# EAGLE design IronSAMD51 (EAGLE 9.0.1)
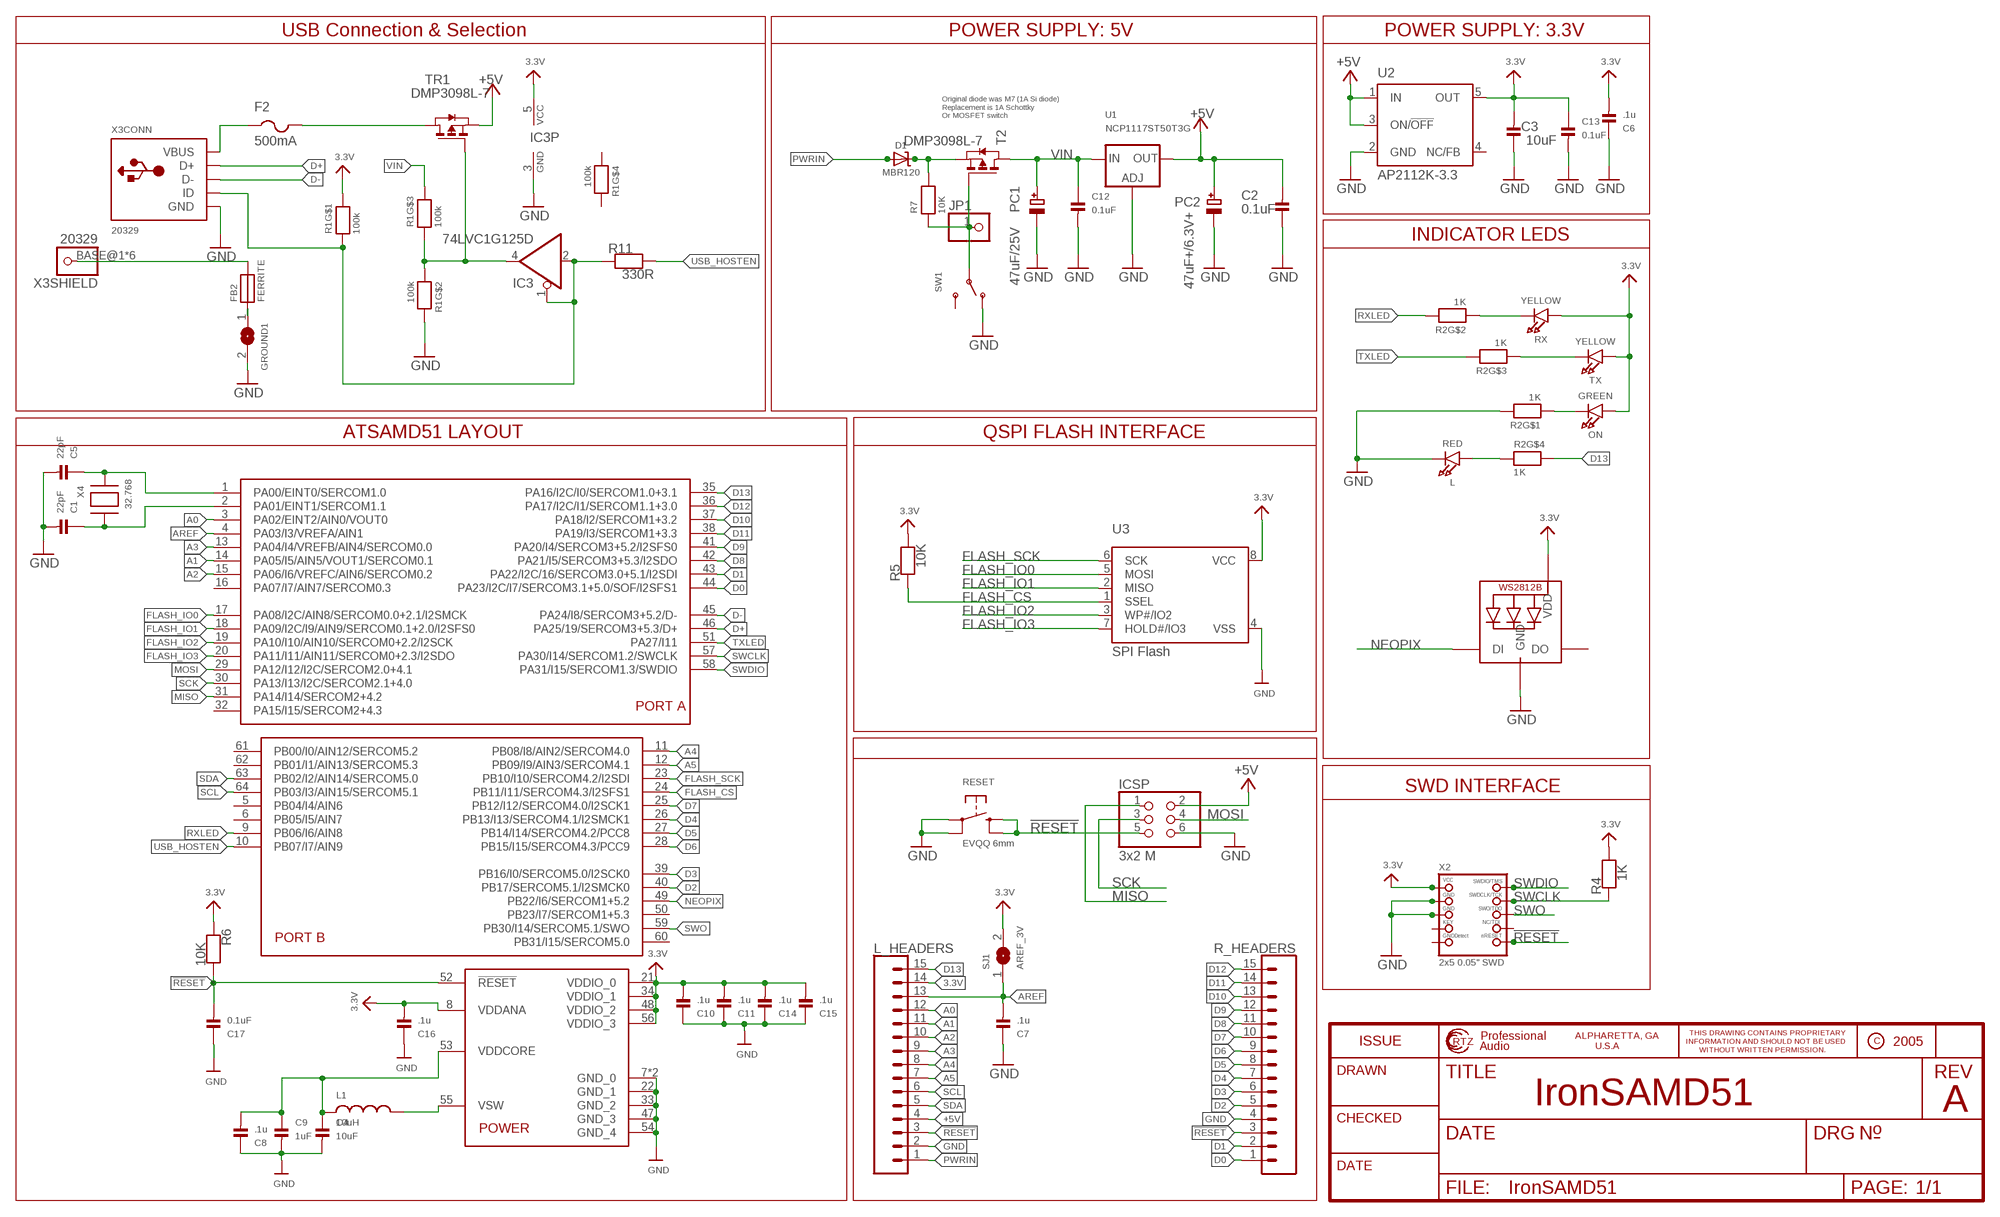
[diagram p0: schematic, sheet 1]

## Parts
C1  22pF  CAP_CERAMIC0603  [0603]
C2  0.1uF  CAP_CERAMIC0805  [0805]
C3  10uF  CAP_CERAMIC0805  [0805]
C4  10uF  CAP_CERAMIC0805  [0805]
C5  22pF  CAP_CERAMIC0603  [0603]
C6  .1u  CAP_CERAMIC0603  [0603]
C7  .1u  CAP_CERAMIC0603  [0603]
C8  .1u  CAP_CERAMIC0603  [0603]
C9  1uF  CAP_CERAMIC0603  [0603]
C10  .1u  CAP_CERAMIC0603  [0603]
C11  .1u  CAP_CERAMIC0603  [0603]
C12  0.1uF  CAP_CERAMIC0603  [0603]
C13  0.1uF  CAP_CERAMIC0603  [0603]
C14  .1u  CAP_CERAMIC0603  [0603]
C15  .1u  CAP_CERAMIC0603  [0603]
C16  .1u  CAP_CERAMIC0603  [0603]
C17  0.1uF  CAP_CERAMIC0603  [0603]
D1  MBR120  DIODE-SCHOTTKYSOD-123  [SOD-123]
F2  500mA  PTCFUSE-1206  [R1206]
FB2  FERRITE  [0603]
GROUND1  SOLDERJUMPERCLOSED  [SOLDERJUMPER_CLOSEDWIRE]
IC3  74LVC1G125D  74AHC1G125DBV  [SOT23-5]
ICSP  3x2 M  HEADER-2X3  [2X03_ROUND_70MIL]
JP1  HEADER-1X1ROUND  [1X01_ROUND]
L  RED  LED0805_NOOUTLINE  [CHIPLED_0805_NOOUTLINE]
L1  10uH  INDUCTOR  [INDUCTOR_1007]
L_HEADERS  CONN_15  [1X15]
LED1  WS2812B3535  [LED3535]
ON  GREEN  LED0805_NOOUTLINE  [CHIPLED_0805_NOOUTLINE]
PC1  47uF/25V  CAP_ELECTROLYTICPANASONIC_D  [PANASONIC_D]
PC2  47uF+/6.3V+  CAP_ELECTROLYTICPANASONIC_D  [PANASONIC_D]
R1  100k  RESISTOR_4PACK  [RESPACK_4X0603]
R2  1K  RESISTOR_4PACK  [RESPACK_4X0603]
R4  1K  RESISTOR0603  [0603]
R5  10K  RESISTOR0603  [0603]
R6  10K  RESISTOR0603  [0603]
R7  10K  RESISTOR0603  [0603]
R11  330R  RESISTOR0603  [0603]
R_HEADERS  CONN_15  [1X15]
RESET  EVQQ 6mm  SWITCH_TACT_SMT  [EVQ-Q2]
RX  YELLOW  LED0805_NOOUTLINE  [CHIPLED_0805_NOOUTLINE]
SJ1  AREF_3V  SOLDERJUMPERCLOSED  [SOLDERJUMPER_CLOSEDWIRE]
SW1  SWITCH_SPDT  [SPDT_SMT_SSSS811101]
T2  DMP3098L-7  PMOSSOT23  [SOT-23]
TR1  DMP3098L-7  0297_PMV48XP  [SOT-23]
TX  YELLOW  LED0805_NOOUTLINE  [CHIPLED_0805_NOOUTLINE]
U1  NCP1117ST50T3G  LM1117SOT223-REFLOW  [SOT223-R]
U2  AP2112K-3.3  LP2985-XXDBVR33  [SOT23-DBV]
U3  SPI Flash  SPIFLASH_SOIC8208MIL  [SOIC8_208MIL]
U$3  ATSAMD51J  [PQFN64-1]
X2  2x5 0.05" SWD  JTAG-CORTEXBOXPOSTS  [2X05_1.27MM_BOX_POSTS]
X3  20329  USB_W_SHIELD_V2  [4UCONN_20329_V2]
X4  32.768  XTAL-3.2X1.5  [XTAL3215]

## Nets
3.3V: C3.2 C6.2 C10.2 C11.2 C13.1 C14.2 C15.2 C16.2 IC3.5(VCC) L_HEADERS.14 LED1.2(VDD) ON.A R1.8 R4.2 R5.2 R6.1 RX.A SJ1.2 TX.A U2.5(OUT) U3.8(VCC) U$3.8(VDDANA) U$3.21(VDDIO_0) U$3.34(VDDIO_1) U$3.48(VDDIO_2) U$3.56(VDDIO_3) X2.1(VCC)
!RESET: C17.2 ICSP.5 L_HEADERS.3 R6.2 R_HEADERS.3 RESET.B'(S1) RESET.B(S) U$3.52(!RESET) X2.10(NRESET)
+5V [usbvcc]: C2.2 ICSP.2 L_HEADERS.4 PC2.+ TR1.2(S) U1.2(OUT) U1.4(OUT) U2.1(IN) U2.3(ON/!OFF)
A0: L_HEADERS.12 U$3.3(PA02/EINT2/AIN0/VOUT0)
A1: L_HEADERS.11 U$3.14(PA05/I5/AIN5/VOUT1/SERCOM0.1)
A2: L_HEADERS.10 U$3.15(PA06/I6/VREFC/AIN6/SERCOM0.2)
A3: L_HEADERS.9 U$3.13(PA04/I4/VREFB/AIN4/SERCOM0.0)
A4: L_HEADERS.8 U$3.11(PB08/I8/AIN2/SERCOM4.0)
A5: L_HEADERS.7 U$3.12(PB09/I9/AIN3/SERCOM4.1)
AREF: C7.2 L_HEADERS.13 SJ1.1 U$3.4(PA03/I3/VREFA/AIN1)
D0: R_HEADERS.1 U$3.44(PA23/I2C/I7/SERCOM3.1+5.0/SOF/I2SFS1)
D1: R_HEADERS.2 U$3.43(PA22/I2C/16/SERCOM3.0+5.1/I2SDI)
D2: R_HEADERS.5 U$3.40(PB17/SERCOM5.1/I2SMCK0)
D3: R_HEADERS.6 U$3.39(PB16/I0/SERCOM5.0/I2SCK0)
D4: R_HEADERS.7 U$3.26(PB13/I13/SERCOM4.1/I2SMCK1)
D5: R_HEADERS.8 U$3.27(PB14/I14/SERCOM4.2/PCC8)
D6: R_HEADERS.9 U$3.28(PB15/I15/SERCOM4.3/PCC9)
D7: R_HEADERS.10 U$3.25(PB12/I12/SERCOM4.0/I2SCK1)
D8: R_HEADERS.11 U$3.42(PA21/I5/SERCOM3+5.3/I2SDO)
D9: R_HEADERS.12 U$3.41(PA20/I4/SERCOM3+5.2/I2SFS0)
D10: R_HEADERS.13 U$3.37(PA18/I2/SERCOM1+3.2)
D11: R_HEADERS.14 U$3.38(PA19/I3/SERCOM1+3.3)
D12: R_HEADERS.15 U$3.36(PA17/I2C/I1/SERCOM1.1+3.0)
D13: L_HEADERS.15 R2.5 U$3.35(PA16/I2C/I0/SERCOM1.0+3.1)
D+: U$3.46(PA25/19/SERCOM3+5.3/D+) X3.D+(CONN:D+)
D-: U$3.45(PA24/I8/SERCOM3+5.2/D-) X3.D-(CONN:D-)
FLASH_CS: R5.1 U3.1(SSEL) U$3.24(PB11/I11/SERCOM4.3/I2SFS1)
FLASH_IO0: U3.5(MOSI) U$3.17(PA08/I2C/AIN8/SERCOM0.0+2.1/I2SMCK)
FLASH_IO1: U3.2(MISO) U$3.18(PA09/I2C/I9/AIN9/SERCOM0.1+2.0/I2SFS0)
FLASH_IO2: U3.3(WP#/IO2) U$3.19(PA10/I10/AIN10/SERCOM0+2.2/I2SCK)
FLASH_IO3: U3.7(HOLD#/IO3) U$3.20(PA11/I11/AIN11/SERCOM0+2.3/I2SDO)
FLASH_SCK: U3.6(SCK) U$3.23(PB10/I10/SERCOM4.2/I2SDI)
GND: C1.2 C2.1 C3.1 C4.2 C5.2 C6.1 C7.1 C8.1 C9.2 C10.1 C11.1 C12.2 C13.2 C14.1 C15.1 C16.1 C17.1 GROUND1.2 IC3.3(GND) ICSP.6 L.C L_HEADERS.2 LED1.4(GND) PC1.- PC2.- R1.7 R2.8 R_HEADERS.4 RESET.A'(P1) RESET.A(P) SW1.A(O) U1.1(ADJ) U2.2(GND) U3.4(VSS) U$3.7(GND_0) U$3.22(GND_1) U$3.33(GND_2) U$3.47(GND_3) U$3.54(GND_4) U$3.EXP(GND_0) X2.3(GND) X2.5(GND) X3.GND(CONN:GND)
MISO: ICSP.1 U$3.31(PA14/I14/SERCOM2+4.2)
MOSI: ICSP.4 U$3.29(PA12/I12/I2C/SERCOM2.0+4.1)
N$1: F2.1 X3.VBUS(CONN:VBUS)
N$3: F2.2 TR1.1(D)
N$4: IC3.4(O) R1.2 R1.3 TR1.3(G)
N$5: ON.C R2.1
N$6: FB2.1 GROUND1.1
N$7: R2.2 RX.C
N$8: R2.3 TX.C
N$9: L.A R2.4
N$10: IC3.1(OE) IC3.2(I) R1.1 R11.1 X3.ID(CONN:ID)
N$11: C5.1 U$3.1(PA00/EINT0/SERCOM1.0) X4.P$1
N$12: C1.1 U$3.2(PA01/EINT1/SERCOM1.1) X4.P$2
N$13: L1.P$2 U$3.55(VSW)
N$14: C4.1 C8.2 C9.1 L1.P$1 U$3.53(VDDCORE)
N$15: D1.C R7.2 T2.2(S)
NEOPIX: LED1.1(DI) U$3.49(PB22/I6/SERCOM1+5.2)
PWR_SWITCH: JP1.1 R7.1 SW1.B(P) T2.3(G)
PWRIN [USB]: D1.A L_HEADERS.1
RXLED: R2.7 U$3.9(PB06/I6/AIN8)
SCK: ICSP.3 U$3.30(PA13/I13/I2C/SERCOM2.1+4.0)
SCL: L_HEADERS.6 U$3.64(PB03/I3/AIN15/SERCOM5.1)
SDA: L_HEADERS.5 U$3.63(PB02/I2/AIN14/SERCOM5.0)
SWCLK: R4.1 U$3.57(PA30/I14/SERCOM1.2/SWCLK) X2.4(SWDCLK)
SWDIO: U$3.58(PA31/I15/SERCOM1.3/SWDIO) X2.2(SWDIO)
SWO: U$3.59(PB30/I14/SERCOM5.1/SWO) X2.6(SWO)
TXLED: R2.6 U$3.51(PA27/I11)
USB_HOSTEN: R11.2 U$3.10(PB07/I7/AIN9)
USHIELD [gnd]: FB2.2 X3.BASE@1 X3.BASE@2 X3.SPRT@1 X3.SPRT@2 X3.SPRT@3 X3.SPRT@4
VIN: C12.1 PC1.+ R1.6 T2.1(D) U1.3(IN)
Unconnected: LED1.3(DO) R1.4 R1.5 SW1.C(S) U2.4(NC/FB) U$3.5(PB04/I4/AIN6) U$3.6(PB05/I5/AIN7) U$3.16(PA07/I7/AIN7/SERCOM0.3) U$3.32(PA15/I15/SERCOM2+4.3) U$3.50(PB23/I7/SERCOM1+5.3) U$3.60(PB31/I15/SERCOM5.0) U$3.61(PB00/I0/AIN12/SERCOM5.2) U$3.62(PB01/I1/AIN13/SERCOM5.3) X2.7(KEY) X2.8(TDI) X2.9(GNDDETECT)

## Notes on the sheet
- USB Connection & Selection | POWER SUPPLY: 5V | POWER SUPPLY: 3.3V
- Original diode was M7 (1A Si diode)
  Replacement is 1A Schottky
  Or MOSFET switch
- INDICATOR LEDS
- ATSAMD51 LAYOUT | QSPI FLASH INTERFACE
- SWD INTERFACE
- IronSAMD51 | A

## Library data of the parts
C1-C17 = microbuilder:CAP_CERAMIC: Ceramic Capacitors 0402 - 0402 Surface Mount Capacitors 16pF 50V 5% [Digikey: 445-4899-2-ND] 18pF 50V 5% [Digikey: 490-1281-2-ND] 22pF 50V 5% [Digikey: 490-1283-2-ND] 68pF 50V 5% [Digikey: 490-1289-2-ND] 0.1uF 10V 10% [Digikey: 490-1318-2-ND] 1.0uF 6.3V 10% [Digikey: 490-1320-2-ND] 0603 - 0603 Surface Mount Capacitors 16 pF 50V 5% [Digikey: 445-5051-2-ND] 22 pF 50V [Digikey: PCC220ACVTR-ND] 33 pF 50V 5% [Digikey: 490-1415-1-ND] 56pF 50V 5% [Digikey: 490-1421-1-ND] 220pF 50V 5% [Digikey: 445-1285-1-ND] 680 pF 50V 2200 pF 50V 5% C0G [Digikey: 445-1297-1-ND] 5600 pF 100V 5% X7R [Digikey: 478-3711-1-ND] 0.1 µF 25V 10% [Digikey: PCC2277TR-ND] 0.22 µF 16V 10% X7R [Digikey: 445-1318-1-ND] 1.0 µF 25V 10% [Digikey: 445-5146-2-ND] 0603 - RF Specific 3pF 250V +/-0.1pF RF [Digikey: 712-1347-1-ND] 18 pF 250V 5% [Digikey: 478-3505-1-ND or 712-1322-1-ND] 56 pF 250V 5% C0G RF [Digikey: 490-4867-1-ND] 68 pF 250V RF [Digikey: 490-4868-1-ND] 0805 - 0805 Surface Mount Capacitors 220 pF 250V 2% RF Ceramic Capacitor [Digikey: 712-1398-1-ND] 1000 pF 50V 2% NP0 Ceramic Capacitor [Digikey: 478-3760-1-ND] 0.1 µF 25V 10% Ceramic Capacitor [Digikey: PCC1828TR-ND] 1.0 µF 16V 10% Ceramic Capacitor[Digikey: 490-1691-2-ND] 10.0 µF 10V 10% Ceramic Capacitor[Digikey: 709-1228-1-ND] 10.0 uF 16V 10% Ceramic Capacitor [Digikey: 478-5165-2-ND] 47 uF 6.3V 20% Ceramic Capacitor [Digikey: 587-1779-1-ND or 399-5506-1-ND] 1206 - 1206 Surface Mount Capacitors 47uF 10V 20% Ceramic Capacitor [Digikey: 490-5528-1-ND or 399-5508-1-ND or 445-6010-1-ND]
D1 = microbuilder:DIODE-SCHOTTKY
F2 = adafruit:PTCFUSE: PTC fuses, resettable thermistors
FB2 = microbuilder:FERRITE: Ferrite Bead 0603 MMZ1608B121C - 120 Ohm, 600mA Ferrite Chip - Digikey: 445-2164-1-ND BK1608HW121-T - 120 Ohm, 600mA Ferrite Chip - Digikey: 587-1876-2-ND
GROUND1 SJ1 = microbuilder:SOLDERJUMPER: SMD Solder JUMPER Solder the two pads together to create a connection, or remove the solder to break it. REFLOW - Use this footprint for solder paste and reflow ovens. WAVE - Use this footprint for hand-soldering (larger pads). CLOSED - Has a trace between the two pads to ensure it is closed by default. The trace needs to be cut to disable the jumper, and can be closed again by creating a solder bridge between the two pads.
IC3 = 74xx-little-de:74*1G125: Single Bus Buffer Gate with 3-State Output
ICSP = microbuilder:HEADER-2X3: PIN HEADER
JP1 = microbuilder:HEADER-1X1: PIN HEADER
L ON RX TX = microbuilder:LED: LED 0603 - 0603 Surface Mount Package 2mA: Green LED - Low Power (3.9mcd, 2ma, 1.7Vf) - Digikey: 475-2709-2-ND Orange LED - Low Power (9.8mcd, 2ma, 1.8Vf) - Digikey: 475-1194-2-ND Red LED - Low Power (5mcd, 2ma, 1.8Vf) - Digikey: 475-1195-2-ND Yellow LED - Low Power (7mcd, 2ma, 1.8Vf) - Digikey: 475-1196-2-ND 5mA: Blue LED - Low Power (17mcd, 5ma, 2.9Vf) - Digikey: LNJ937W8CRACT-ND 0805 - 0805 Surface Mount Package 2mA: Red LED (8.8mcd, 2mA, 1.8Vf, Clear) - Low Power [Digikey: 475-2510-1-ND] Green LED (5mcd, 2mA, 1.8Vf, Clear) - Low Power [Digikey: 475-2730-1-ND] Yellow LED (11.3mcd, 2mA, 1.8Vf, Clear) - Low Power [Digikey: 475-2555-1-ND] 20mA: Red LED (104mcd, 20mA, Diffused) - LS R976 [Digikey: 475-1278-6-ND] Red LED (12mcd, 20mA, 2.0Vf, Clear) - APT2012EC [Digikey: 754-1128-1-ND] Green LED (15mcd, 20mA, 2.2Vf, Clear) - APT2012GC [Digikey: 754-1131-1-ND] Orange LED (160mcd, 20mA, 2.1Vf, Clear) - APT2012SECK [Digikey: 754-1130-1-ND] 1206 - 1206 Surface Mount Package Green LED (26mcd, 20mA, Diffused) - LG N971 [Digikey: 475-1407-6-ND] Red LED (15mcd, 20mA, Diffused) - LH N974 [Digikey: 475-1416-6-ND] Cree - Cree High-Power Surface Mount LEDs XPEBWT-L1-0000-00D50 - White 111lm 350mA 2.9Vf 6200K 110° XTEAWT-00-0000-00000LEE3 - White 114lm 350mA 2.85Vf 5000K 115° Everlight - Everlight 45-21 Series Surface Mount LEDs 45-21/QK2C-B2832AC2CB2/2T - Warm White 2000mcd 20mA 3.25Vf 3050K 120° 45-21/LK2C-B38452C4CB2/2T - Nuetral White 2000mcd 20mA 3.25Vf 4150K 120° 45-21/LK2C-B50634C6CB2/2T - Cold White 2200mcd 20mA 3.25Vf 5650K 120° PLCC2 Reverse Mount LS T77K-J1L2-1-0-2-R18-Z - Red 11.25mcd 2mA 1.8Vf 630nm 120° LO T77K-L1M2-24-Z - Orange 19.6mcd 2mA 1.8Vf 606nm 120° LY T77K-K2M1-26-Z - Yellow 15.7mcd 2mA 1.8Vf 587nm 120°
L1 = microbuilder:INDUCTOR: Inductors 0603: 10nH Ceramic Inductor - microwire antenna/RF (Digikey: 712-1434-2-ND) 0805: 560nH Ceramic Inductor - RF (Digikey: 553-1047-1-ND) 1007 (2518 Metric) SMT: 10µH 10% 250mOhm 820mA 1007 Inductor (Digikey: 587-2189-1-ND) 22µH 10% 500mOhm 580mA 1007 Inductor (Digikey: 587-2190-1-ND) 47µH 10% 950mOhm 420mA 1007 Inductor (Digikey: 587-2191-1-ND) 47µH 5% 100mOhm 1A 1008 Inductor (Digikey: 732-1816-1-ND) 6.0x6.0mm: 4.7µH 20% 3.8A 27mOhm Inductor (Digikey: 445-6538-2-ND)
L_HEADERS R_HEADERS = SparkFun-Connectors:CONN_15: Multi connection point. Often used as Generic Header-pin footprint for 0.1 inch spaced/style header connections On any of the 0.1 inch spaced packages, you can populate with these: Break Away Headers - Straight (PRT-00116) Break Away Male Headers - Right Angle (PRT-00553) Female Headers (PRT-00115) Break Away Headers - Machine Pin (PRT-00117) Break Away Female Headers - Swiss Machine Pin (PRT-00743) For SCREWTERMINALS and SPRING TERMINALS visit here: Screw Terimnals on SparkFun.com (5mm/3.5mm/2.54mm spacing) This device is also useful as a general connection point to wire up your design to another part of your project. Our various solder wires solder well into these plated through hole pads. Hook-Up Wire - Assortment (Stranded, 22 AWG) (PRT-11375) Hook-Up Wire - Assortment (Solid Core, 22 AWG) (PRT-11367) View the entire wire category on our website here Special notes: Molex polarized connector foot print use with SKU : PRT-08231 with associated crimp pins and housings. 1MM SMD Version SKU: PRT-10208 NOTES ON THE VARIANTS LOCK and LOCK_LONGPADS... This footprint was designed to help hold the alignment of a through-hole component (i.e. 6-pin header) while soldering it into place. You may notice that each hole has been shifted either up or down by 0.005 of an inch from it's more standard position (which is a perfectly straight line). This slight alteration caused the pins (the squares in the middle) to touch the edges of the holes. Because they are alternating, it causes a "brace" to hold the component in place. 0.005 has proven to be the perfect amount of "off-center" position when using our standard breakaway headers. Although looks a little odd when you look at the bare footprint, once you have a header in there, the alteration is very hard to notice. Also,if you push a header all the way into place, it is covered up entirely on the bottom side.
LED1 = microbuilder:WS2812B
PC1 PC2 = microbuilder:CAP_ELECTROLYTIC: Electrolytic Capacitors SMT PANASONIC_C - Size C Panasonic Electrolytic Aluminum Capacitor 47µF 16V 20% Electrolytic Capacitor [Digikey: PCE3890TR-ND] PANASONIC_D - Size D Panasonic Electrolytic Aluminum Capacitor 100µF 25V 20% Electrolytic Capacitor [Digikey: PCE3898TR-ND] PTH 3.5 mm grid, 8 mm diameter ... 3.5 mm grid, 10 mm diameter ...
R1 R2 = microbuilder:RESISTOR_4PACK: Resistor Packs (4 resistors) 4 x 0603 10K 1/16W - Digikey: YC164J-10KCT-ND
R4-R7 R11 = microbuilder:RESISTOR: Resistors 0402 - 0402 Surface Mount Package 22 Ohm 1% 1/16W [Digikey: 311-22.0LRTR-ND] 33 Ohm 5% 1/16W 1.0K 5% 1/16W 1.5K 5% 1/16W 2.0K 1% 1/16W 10.0K 1% 1/16W [Digikey: 311-10.0KLRTR-ND] 10.0K 5% 1/16W [Digikey: RMCF0402JT10K0TR-ND] 12.1K 1% 1/16W [Digikey: 311-22.0LRTR-ND] 100.0K 5% 1/16W 0603 - 0603 Surface Mount Package 0 Ohm 1/10 Watt 1% Resistor 15 Ohm 1/10 Watt 1% Resistor 33 Ohm 1/10 Watt 1% Resistor 49.9 Ohm 1/10 Watt 1% Resistor 100 Ohm 1/10 Watt 1% Resistor 150 Ohm 1/10 Watt 1% Resistor 240 Ohm 1/10 Watt 1% Resistor 390 Ohm 1/10 Watt 1% Resistor 560 Ohm 1/10 Watt 1% Resistor 680 Ohm 1/10 Watt 1% Resistor 750 Ohm 1/10 Watt 1% Resistor 1.0K Ohm 1/10 Watt 1% Resistor 1.5K Ohm 1/10 Watt 1% Resistor 2.0K Ohm 1/10 Watt 1% Resistor 2.2K Ohm 1/10 Watt 1% Resistor 3.3K Ohm 1/10 Watt 1% Resistor 4.7K Ohm 1/10 Watt 1% Resistor 10.0K Ohm 1/10 Watt 1% Resistor 12.0K Ohm 1/10 Watt 1% Resistor 12.1K Ohm 1/10 Watt 1% Resistor 20.0K Ohm 1/10 Watt 1% Resistor 33.0K Ohm 1/10 Watt 1% Resistor 100.0K Ohm 1/10 Watt 1% Resistor 0805 - 0805 Surface Mount Package 0 Ohm 1/8 Watt 1% Resistor 33 Ohm 1/8 Watt 1% Resistor 100 Ohm 1/8 Watt 1% Resistor 150 Ohm 1/8 Watt 1% Resistor 200 Ohm 1/8 Watt 1% Resistor 240 Ohm 1/8 Watt 1% Resistor 330 Ohm 1/8 Watt 1% Resistor 390 Ohm 1/8 Watt 1% Resistor 470 Ohm 1/8 Watt 1% Resistor 1.0K Ohm 1/8 Watt 1% Resistor 1.5K Ohm 1/8 Watt 1% Resistor 2.0K Ohm 1/8 Watt 1% Resistor 4.7K Ohm 1/8 Watt 1% Resistor 5.1K Ohm 1/8 Watt 1% Resistor 5.6K Ohm 1/8 Watt 1% Resistor 10.0K Ohm 1/8 Watt 1% Resistor 22.0K Ohm 1/8 Watt 1% Resistor 33.0K Ohm 1/8 Watt 1% Resistor 100K Ohm 1/8 Watt 1% Resistor 1206 - 1206 Surface Mount Package 2012 - 2010 Surface Mount Package 0.11 Ohm 1/2 Watt 1% Resistor - Digikey: RHM.11UCT-ND
RESET = microbuilder:SWITCH_TACT_SMT: SMT Tact Switches 6x6mm - Digikey: P12940SCT-ND KMR2 (4.6x2.8mm) - Digikey: 401-1426-1-ND EVQ-PQHB55 - Light Touch, 160GF (4.5x4.5mm) - Digikey: P8090SCT-ND KMT0 - KMT021 NGJ LHS (etc.) IP68/Waterproof - Digikey: CKN10289CT-ND
SW1 = microbuilder:SWITCH_SPDT: Switch - SPDT SSSS811101 - Horizontal Two Position SMT, 0.3A 4V [Mouser: 688-SSSS811101]
T2 = zetex:PMOSSOT23: MOS FET; OC_FARNELL: unknown; OC_NEWARK: unknown
TR1 = Transistors:0297_PMV48XP: 20 V, 3.5 A P-channel Trench MOSFET - PMV48XP; CASE: SOT23; MONTHLY_USAGE: _____; PART_NUMBER: PMV48XP; PRICE: _____; SUPPLIER: _____; TYPE: Transistor; VALUE: PMV48XP
U1 = microbuilder:LM1117: LM1117 Voltage Regulator LM1117 Adjustable Voltage regulator [Digikey: LM1117IMP-ADJDKR-ND] LM1117 3.3V Voltage regulator [AP1117E33GDIDKR-ND] LM1117 5.0V Voltage regulator [AP1117E50GDIDKR-ND] SOT223-REFLOW - SOT223 package for solder paste/reflow ovens SOT223-WAVE - SOT223 package for hand-soldering (larger pads) Note: For the fixed-voltage regulators, simply set the ADJ pin to GND.
U2 = SmartPrj:LP2985-XXDBVR: ULTRALOW-POWER 50-mA LOW-DROPOUT LINEAR REGULATORS 50-mA Low-Dropout Regulator Source: http://focus.ti.com/lit/ds/symlink/tps77001.pdf
U3 = microbuilder:SPIFLASH_SOIC8: SOIC8 SPI Flash Be careful with the size since SOIC8 flash comes in several 'widths' SOIC8 150 mil M25P16 - 16Mbit (2Mbit x 8) Serial Flash (75MHz SPI Bus), Supply: 2.7-3.6V Digikey: SOIC8 - M25P16-VMN6P-ND SOIC8 208 mil W25Q16BVSSIG - 16Mbit (2Mbit x 8) Serial Flash (104MHz SPI Bus), Supply: 2.7-3.6V Digikey: SOIC8 - W25Q16BVSSIG-ND
U$3 = microbuilder:ATSAMD51J: ATSAMD51J cortex m4 microcontroller
X2 = microbuilder:JTAG-CORTEX: Serial Wire (SW-DP) Connector Standard 0.05" 10-pin connector is for use with the Cortex M and Cortex A SWD (serial wire debugger) interface (SW-DP) Connectors 2x05_1.27MM_SMT - Inexpensive surface-mount header with bare pins, compatible with standard 10-pin SWD cables (4UCON: 16846) 2x05_1.27MM_BOX_NOPOSTS - Polarised surface-mount box (4UCON with caps: 19735, without caps: 15117 2x05_1.27MM_BOX_POSTS - Polarised surface-mount box with mounting holes (4UCON: 20317) Pinout: http://infocenter.arm.com/help/topic/com.arm.doc.faqs/attached/13634/cortex_debug_connectors.pdf http://www.keil.com/peripherals/coresight/connectors.asp
X3 = microbuilder:USB_W_SHIELD
X4 = adafruit2:XTAL: Low cost SMT crystals, no capacitors included http://www.ladyada.net/library/eagle

## Board
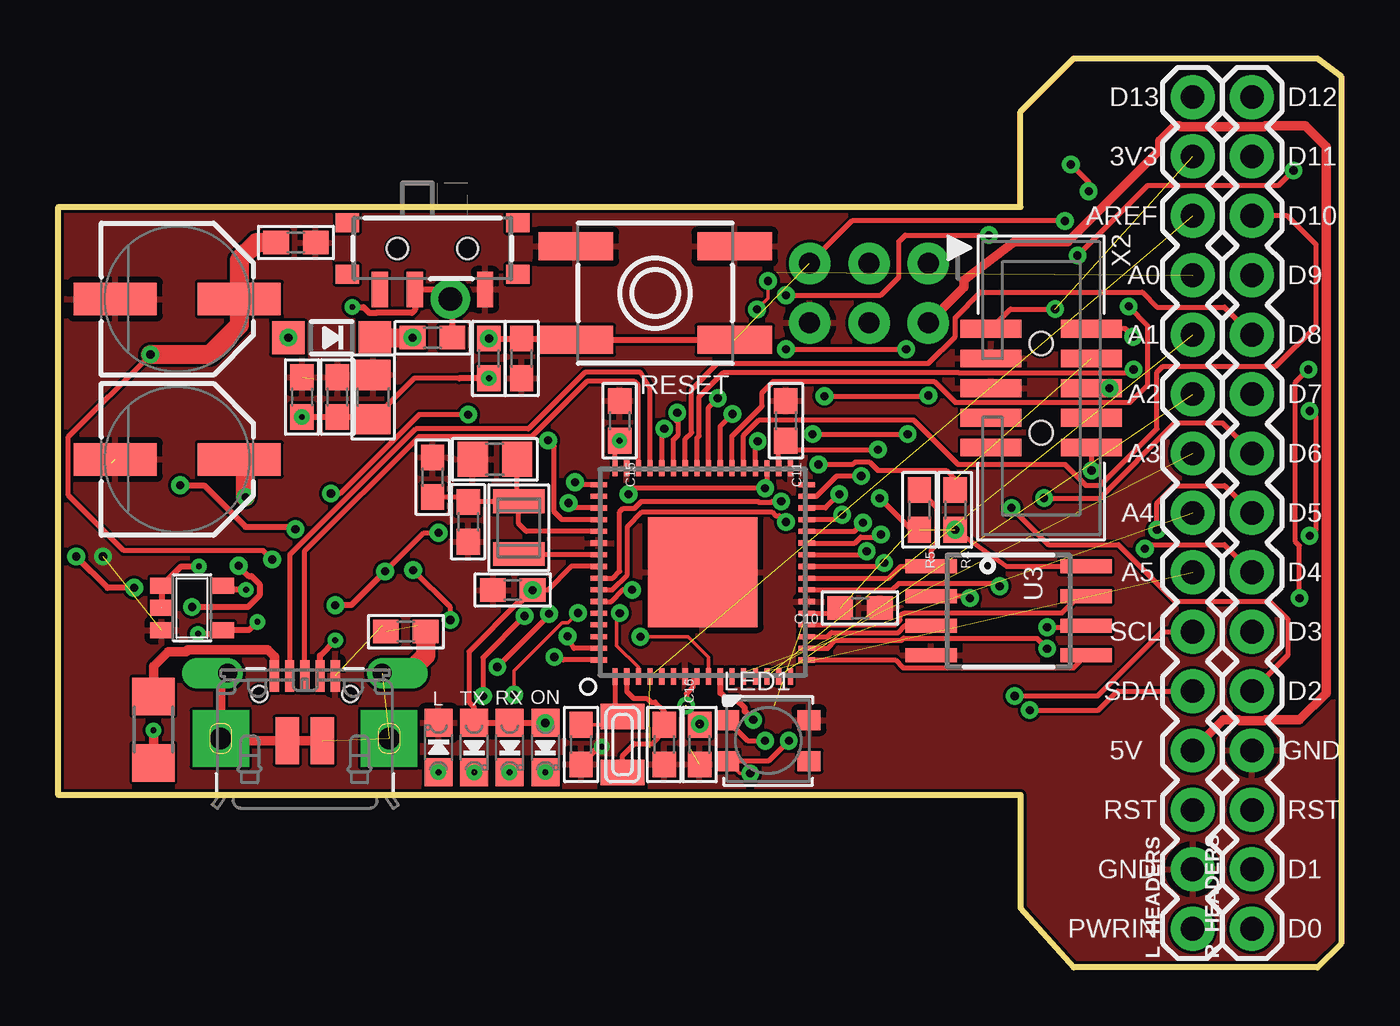
[diagram p1: board, top side]
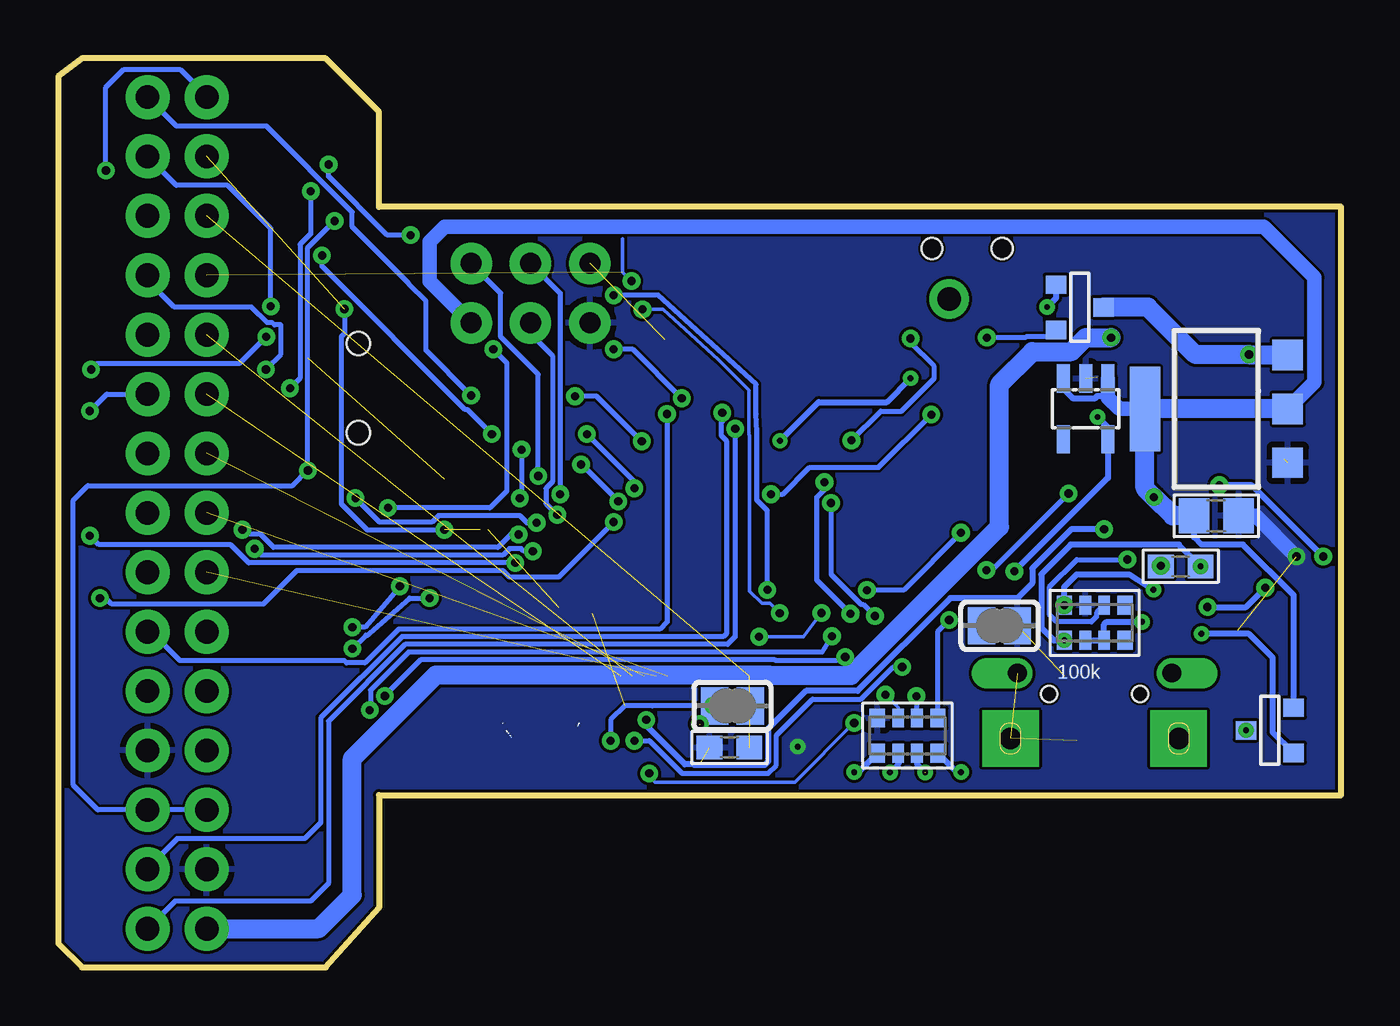
[diagram p2: board, bottom side, seen from below]

Size 54.86 x 38.86 mm. Coordinates in mm from the lower left corner, seen from the top.
Outline: 0,7.37 0,32.51 41.15,32.51 41.15,36.58 43.43,38.86 53.85,38.86 54.86,38.1 54.86,1.02 53.85,0 43.43,0 41.15,2.54 41.15,7.37 0,7.37
Copper layers (1*16): Top 0.035mm / dielectric 1.5mm / Bottom 0.035mm
Design rules "default *": minimum track width 6mil, minimum drill 0.35mm, track to track 5mil, track to pad 5mil, pad to pad 5mil, via to via 5mil, smd to smd 5mil, copper to edge 5mil, drill to drill 6mil, minimum pad ring 10mil, minimum via ring 8mil, stop-mask expansion 4mil, vias tented up to drill 0mil, thermal gap 10mil

### Footprints (pad centres in the part's own frame; a part is rotated, then mirrored left to right if it is on the bottom)
0603 = smd 1.1 x 1: 1 -0.85,0; 2 0.85,0
0805 = smd 1.3 x 1.5: 1 -0.95,0; 2 0.95,0
SOD-123 = smd 1.4 x 1.4: A 1.85,0; C -1.85,0
R1206 = smd 1.6 x 1.803: 1 -1.422,0; 2 1.422,0
SOLDERJUMPER_CLOSEDWIRE = smd 1.168 x 1.6: 1 -0.762,0; 2 0.762,0 | smd 0.635 x 0.203: WIRE 0,0
SOT23-5 = smd 0.69 x 0.99: 1 -0.95,-1.29; 2 0,-1.29; 3 0.95,-1.29; 4 0.95,1.3; 5 -0.95,1.3
2X03_ROUND_70MIL = drill 0.9 pad 1.778: 1 -2.54,-1.27; 2 -2.54,1.27; 3 0,-1.27; 4 0,1.27; 5 2.54,-1.27; 6 2.54,1.27
1X01_ROUND = drill 1 pad 1.676: 1 0,0
CHIPLED_0805_NOOUTLINE = smd 1.2 x 1.2: A 0,-1.05; C 0,1.05
INDUCTOR_1007 = smd 1.016 x 2.2: P$1 -1.127,0; P$2 1.127,0
1X15 = drill 1.016 pad 1.88: 1 0,0; 2 2.54,0; 3 5.08,0; 4 7.62,0; 5 10.16,0; 6 12.7,0; 7 15.24,0; 8 17.78,0; 9 20.32,0; 10 22.86,0; 11 25.4,0; 12 27.94,0; 13 30.48,0; 14 33.02,0; 15 35.56,0
LED3535 = smd 1 x 0.85: 1 -1.75,0.875; 2 -1.75,-0.875; 3 1.75,-0.875; 4 1.75,0.875
PANASONIC_D = smd 3.556 x 1.4: + 2.654,0; - -2.654,0
RESPACK_4X0603 = smd 0.65 x 0.8: 1 -1.3,-0.75; 4 1.3,-0.75; 5 1.3,0.75; 8 -1.3,0.75 | smd 0.5 x 0.8: 2 -0.4,-0.75; 3 0.4,-0.75; 6 0.4,0.75; 7 -0.4,0.75
EVQ-Q2 = smd 3.2 x 1.2: A -3.4,-2; A' 3.4,-2; B -3.4,2; B' 3.4,2
SPDT_SMT_SSSS811101 = smd 0.7 x 1.5: A -2.25,1.75; B 0.75,1.75; C 2.25,1.75 | smd 1 x 0.8: SUP1 -3.65,1.1; SUP2 -3.65,-1.1; SUP3 3.65,1.1; SUP4 3.65,-1.1 | hole 0.9: -1.5,0; 1.5,0
SOT-23 = smd 0.787 x 0.889: 1 0.025,-1.016; 2 -0.94,1.016; 3 0.991,1.016
SOT223-R = smd 1.3 x 1.3: 1 -2.3,-3.05; 2 0,-3.05; 3 2.3,-3.05 | smd 3.6 x 1.3: 4 0,3.05
SOT23-DBV = smd 0.55 x 1.2: 1 -0.95,-1.3; 2 0,-1.3; 3 0.95,-1.3; 4 0.95,1.3; 5 -0.95,1.3
SOIC8_208MIL = smd 0.6 x 2.2: 1 -1.905,-3.315; 2 -0.635,-3.315; 3 0.635,-3.315; 4 1.905,-3.315; 5 1.905,3.315; 6 0.635,3.315; 7 -0.635,3.315; 8 -1.905,3.315
PQFN64-1 = smd 0.7 x 0.22: 1 -4.45,3.75; 2 -4.45,3.25; 3 -4.45,2.75; 4 -4.45,2.25; 5 -4.45,1.75; 6 -4.45,1.25; 7 -4.45,0.75; 8 -4.45,0.25; 9 -4.45,-0.25; 10 -4.45,-0.75; 11 -4.45,-1.25; 12 -4.45,-1.75; 13 -4.45,-2.25; 14 -4.45,-2.75; 15 -4.45,-3.25; 16 -4.45,-3.75; 33 4.45,-3.75; 34 4.45,-3.25; 35 4.45,-2.75; 36 4.45,-2.25; 37 4.45,-1.75; 38 4.45,-1.25; 39 4.45,-0.75; 40 4.45,-0.25; 41 4.45,0.25; 42 4.45,0.75; 43 4.45,1.25; 44 4.45,1.75; 45 4.45,2.25; 46 4.45,2.75; 47 4.45,3.25; 48 4.45,3.75 | smd 0.22 x 0.7: 17 -3.75,-4.45; 18 -3.25,-4.45; 19 -2.75,-4.45; 20 -2.25,-4.45; 21 -1.75,-4.45; 22 -1.25,-4.45; 23 -0.75,-4.45; 24 -0.25,-4.45; 25 0.25,-4.45; 26 0.75,-4.45; 27 1.25,-4.45; 28 1.75,-4.45; 29 2.25,-4.45; 30 2.75,-4.45; 31 3.25,-4.45; 32 3.75,-4.45; 49 3.75,4.45; 50 3.25,4.45; 51 2.75,4.45; 52 2.25,4.45; 53 1.75,4.45; 54 1.25,4.45; 55 0.75,4.45; 56 0.25,4.45; 57 -0.25,4.45; 58 -0.75,4.45; 59 -1.25,4.45; 60 -1.75,4.45; 61 -2.25,4.45; 62 -2.75,4.45; 63 -3.25,4.45; 64 -3.75,4.45 | smd 4.7 x 4.7: EXP 0,0
2X05_1.27MM_BOX_POSTS = smd 0.76 x 2.6: 1 -2.54,-2.15; 2 -2.54,2.15; 3 -1.27,-2.15; 4 -1.27,2.15; 5 0,-2.15; 6 0,2.15; 7 1.27,-2.15; 8 1.27,2.15; 9 2.54,-2.15; 10 2.54,2.15 | hole 1: -1.905,0; 1.905,0
4UCONN_20329_V2 = smd 1 x 2: BASE@1 -0.75,-2; BASE@2 0.75,-2 | smd 0.4 x 1.35: D+ 0,0.775; D- -0.65,0.775; GND 1.3,0.775; ID 0.65,0.775; VBUS -1.3,0.775 | drill 0.8 pad 1.143 offset: SPRT@1 -3.3,0.9; SPRT@2 3.3,0.9 | drill 0.9 pad 2.413 square: SPRT@3 -3.6,-1.9; SPRT@4 3.6,-1.9 | hole 0.7: -1.95,0; 1.95,0
XTAL3215 = smd 1.1 x 1.9: P$1 1.2,0; P$2 -1.2,0

### Placement (x,y rotation side)
C1  25.91,9.52 270 top
C2  5.33,19.3 180 bottom
C3  13.46,24.38 270 top
C4  18.67,21.72 180 top
C5  22.35,9.52 270 top
C6  10.41,24.38 270 top
C7  26.16,9.4 0 bottom
C8  16,20.95 270 top
C9  17.53,19.05 270 top
C10  34.29,15.37 180 top
C11  31.11,23.37 270 top
C12  10.16,30.99 0 top
C13  11.94,24.38 90 top
C14  19.43,16.13 0 top
C15  24,23.37 270 top
C16  27.43,9.52 90 top
C17  19.81,26.04 90 top
D1  11.68,26.92 180 top
F2  4.06,10.16 270 top
FB2  14.86,14.35 0 top
GROUND1  14.6,14.6 0 bottom
IC3  5.71,15.37 270 top
ICSP  34.67,28.83 180 top
JP1  16.76,28.57 0 top
L  16.26,9.4 0 top
L1  19.69,18.8 270 top
L_HEADERS  48.51,1.65 90 top
LED1  30.35,9.69 0 top
ON  20.83,9.4 180 top
PC1  5.08,28.57 0 top
PC2  5.08,21.72 0 top
R1  10.54,14.73 0 bottom
R2  18.54,9.91 0 bottom
R4  38.35,19.56 270 top
R5  36.83,19.56 270 top
R6  18.41,26.04 90 top
R7  16,26.92 180 top
R11  6.86,17.15 180 bottom
R_HEADERS  51.05,1.65 90 top
RESET  25.53,28.83 180 top
RX  19.3,9.4 180 top
SJ1  26.03,11.18 180 bottom
SW1  16,30.73 180 top
T2  11.18,28.19 90 bottom
TR1  3.05,10.16 270 bottom
TX  17.78,9.4 180 top
U1  5.33,23.88 90 bottom
U2  10.92,23.88 180 bottom
U3  40.64,15.24 270 top
U$3  27.56,16.89 90 top
X2  42.04,24.76 270 top
X3  10.54,11.68 0 top
X4  24.13,9.52 90 top

### Tracks (layer width: path | path; a pad name or v marks a point on that pad's centre or on a via)
3.3V  (via drill 0.25, 0.35)  (6 unrouted)
  Top 0.152: v29.59,8.29 29.13,8.29 LED1.2
  Top 0.203: U$3.56 21.93,17.14 20.92,16.13 C14.2 19.78,15.63 19.69,15.63 17.55,13.5 17.55,11.34 17.78,11.12 TX.A | v13.97,16.93 15.62,18.58 v16.26,18.58 | U$3.48 23.81,22.32 C15.2 | U$3.34 30.81,22.21 C11.2 31.5,22.14 v35.05,22.14 | 39.75,27.44 X2.1 40.73,28.15 v42.63,28.15 | U$3.21 33.21,15.14 C10.2 | U$3.8 27.15,12.28 27.15,12 26.86,11.71 v26.86,11.19 | v31.24,9.69 30.37,8.81 LED1.2 | R4.2 40.55,17.15 U3.8 | 17.15,25.18 15.21,25.18 C3.2 | v35.13,20.06 36.48,18.71 R5.2
  Top 0.254: TX.A RX.A ON.A | C6.2 C13.1 13.36,23.53 C3.2 | R6.1 17.15,25.18 | v8.02,16.15 7.19,16.15 IC3.5 | v13.97,16.93 12.52,15.48 R1.8
  Bottom 0.152: ON.A 23.36,7.91 29.34,7.91 29.59,8.17 v29.59,8.29
  Bottom 0.203: v16.26,18.58 18.71,16.13 C14.2 | v27.43,10.4 27.43,10.54 SJ1.2 29.46,11.18 29.47,11.19 30.64,11.19 31.24,10.58 v31.24,9.69 | v42.63,28.15 42.63,27.1 42.77,26.97 42.77,19.82 41.66,18.71 R4.2 | v35.05,22.14 35.05,20.13 v35.13,20.06
  Bottom 0.254: R1.8 11.84,16.26 11.3,16.8 9.06,16.8 v8.02,16.15 | C6.2 9.97,23.09 U2.5 9.97,20.93 v13.97,16.93 | C15.2 22.35,24.17 19.43,24.17 R6.1
  other vias: 10.41,23.53 24,22.52 18.41,25.18 11.84,15.48 20.28,16.13 38.35,18.71 20.83,10.45
!RESET  (via drill 0.35)  (1 unrouted)
  Top 0.203: U$3.52 21.54,19.14 21.21,19.47 21.21,22.26 v20.94,22.53 | X2.10 44.19,21.26 v44.2,21.25 | v43.05,31.91 33.95,31.91 ICSP.5
  Top 0.254: R6.2 C17.2 22.07,26.88 RESET.B' RESET.B
  Bottom 0.203: v20.94,22.53 19.69,23.79 18.8,23.79 17.4,25.18 17.4,25.69 18.41,26.71 R6.2 | v43.05,31.91 44.2,30.77 v44.2,21.25 44.84,20.6 53.61,20.6 54.23,19.98 54.23,7.78 53.18,6.73 R_HEADERS.3 L_HEADERS.3
  other vias: 18.41,26.88
+5V  (via drill 0.35)
  Top 0.406: L_HEADERS.4 49.82,10.58 50.49,10.58 50.53,10.54 51.58,10.54 51.62,10.58 53.09,10.58 54.23,11.72 54.23,35.09 53.34,35.98 51.62,35.98 51.58,35.94 47.99,35.94 47.95,35.98 47.75,35.98 47.12,35.34 47.12,34.96 43.18,31.03 40.89,31.03 38.74,29.37 38.74,29.08 ICSP.2
  Top 0.813: v8,20.1 8,21.45 PC2.+
  Bottom 0.254: TR1.2 2.03,15.91 4.19,18.07 5.97,18.07 6.28,18.39 C2.2 | 9.97,24.42 10.44,24.42 10.54,24.32 11.46,24.32 11.87,24.74 U2.3
  Bottom 0.61: U2.1 9.97,24.42 9.97,24.36 9.49,23.88 U1.4 | U1.2 1.14,25.02 1.14,29.5 3.3,31.66 38.35,31.66 38.99,31.03 38.99,29.34 ICSP.2
  Bottom 0.813: U1.2 U1.4 8.38,20.49 v8,20.1 7.2,19.3 C2.2
A0  (via drill 0.35)  (1 unrouted)
  Top 0.152: U$3.3 24.81,12.82 23.88,13.75 23.88,15.01 v24.01,15.14 | v29.88,28.13 30.35,28.61 v30.35,29.35
  Bottom 0.152: v24.01,15.14 24.42,15.56 24.78,15.56 25.3,16.07 25.3,22.74 25.32,22.77 25.32,23.65 25.33,23.77 25.32,23.78 25.32,24.68 26.64,25.99 29,28.13 v29.88,28.13 | v30.35,29.35 30.73,29.73 30.73,31.15
A1  (1 unrouted)
A2  (1 unrouted)
A3  (1 unrouted)
A4  (1 unrouted)
A5  (1 unrouted)
AREF  (3 unrouted)
D0  (via drill 0.35)
  Top 0.203: U$3.44 25.81,22.92 v25.92,23.02
  Bottom 0.203: v25.92,23.02 25.92,14.13 26.24,13.8 40.03,13.8 43.31,10.53 43.31,3.59 44.07,2.83 49.87,2.83 R_HEADERS.1
D1  (via drill 0.35)
  Top 0.203: v26.47,23.72 26.31,23.55 26.31,23.49 26.52,23.28 26.52,22.77 26.31,22.56 U$3.43
  Bottom 0.203: v26.47,23.72 26.47,23.32 26.52,23.28 26.52,22.75 26.29,22.52 26.29,14.26 26.42,14.13 | 26.42,14.13 | 26.42,14.13 40.17,14.13 43.64,10.66 43.64,6.18 44.32,5.5 49.78,5.5 51.05,4.23 R_HEADERS.2
D2  (via drill 0.35)
  Top 0.203: U$3.40 27.81,23.94 v28.2,24.33 | v31.12,26.43 v36.26,26.43 | v40.77,19.65 42.34,18.07 45.34,18.07 47.75,15.66 51.82,15.66 52.58,14.9 52.58,13.34 R_HEADERS.5
  Bottom 0.203: v28.2,24.33 30.3,26.43 v31.12,26.43 | v36.26,26.43 35.69,25.85 35.69,20.36 36.4,19.65 v40.77,19.65
D3  (via drill 0.35)
  Top 0.203: U$3.39 28.31,23.14 v28.83,23.66
  Bottom 0.203: v28.83,23.66 28.83,14.77 29.13,14.46 40.31,14.46 41.76,13.02 42.54,13.02 42.64,13.12 49.66,13.12 50.89,14.35 R_HEADERS.6
D4  (via drill 0.35)
  Top 0.203: U$3.26 34.42,17.64 v34.57,17.79 | v46.47,17.9 46.64,18.07 49.87,18.07 R_HEADERS.7
  Bottom 0.203: v34.57,17.79 34.96,17.79 35.07,17.9 35.57,17.9 35.85,17.62 46.19,17.62 v46.47,17.9
D5  (via drill 0.35)
  Top 0.203: U$3.27 34.06,18.14 34.32,18.4 35.07,18.4 v35.18,18.51 | v46.99,18.71 46.99,19.85 47.74,20.6 49.89,20.6 R_HEADERS.8
  Bottom 0.203: v35.18,18.51 35.51,18.51 36.06,17.95 45.67,17.95 46.22,18.51 46.79,18.51 v46.99,18.71
D6  (via drill 0.35)
  Top 0.203: U$3.28 34.05,18.64 v34.41,19.01 | v42.16,20.07 44.54,20.07 47.75,23.28 49.78,23.28 51.05,22.01 R_HEADERS.9
  Bottom 0.203: v34.41,19.01 34.82,19.01 35.13,19.31 38.6,19.31 38.88,19.04 41.13,19.04 v42.16,20.07
D7  (via drill 0.35)
  Top 0.203: U$3.25 35.17,17.14 v35.32,17.29 | v53.52,18.45 53.8,18.73 53.8,23.53 53.54,23.79 v53.52,23.79
  Bottom 0.203: v35.32,17.29 46.72,17.29 47.5,18.07 53.14,18.07 v53.52,18.45 | v53.52,23.79 52.8,24.51 R_HEADERS.10
D8
  Top 0.203: U$3.42 26.81,22.59 27.08,22.86 27.08,24.7 28.2,25.82 37.21,25.82 38.36,26.96 38.36,27.78 39.45,28.87 46.36,28.87 46.99,28.23 49.87,28.23 R_HEADERS.11
D9  (via drill 0.35)
  Top 0.203: U$3.41 27.31,22.63 27.41,22.73 27.41,24.4 28.45,25.44 38.48,25.44 38.49,25.43 45.85,25.43 v45.99,25.56
  Bottom 0.203: R_HEADERS.12 51.05,29.37 49.91,28.23 46.61,28.23 45.95,27.57 45.72,27.57 45.62,27.47 45.34,27.47 45.34,26.22 v45.99,25.56
D10
  Top 0.203: U$3.37 29.31,22.74 29.97,23.41 36.58,23.41 38.48,21.5 43.05,21.5 43.94,20.61 44.58,20.61 46.99,23.02 46.99,25.44 47.24,25.69 52.07,25.69 53.8,27.42 53.8,30.9 52.57,32.13 R_HEADERS.13
D11  (via drill 0.35)
  Top 0.203: v45.78,28.26 46.6,27.44 46.6,24.92 45.84,24.16 38.37,24.16 37.47,25.06 30.58,25.06 30.1,24.58 30.1,24 28.81,22.71 U$3.38
  Bottom 0.203: v45.78,28.26 45.78,31.59 47.63,33.44 49.82,33.44 R_HEADERS.14
D12  (via drill 0.35)
  Top 0.203: U$3.36 29.81,22.38 v29.92,22.49 | v32.77,24.42 37.18,24.42 v37.21,24.45
  Bottom 0.203: v29.92,22.49 31.85,24.42 v32.77,24.42 | v37.21,24.45 39.14,26.38 39.14,28.48 39.88,29.22 39.88,29.25 42.29,31.66 42.29,32.3 45.98,35.98 49.82,35.98 R_HEADERS.15
D13  (via drill 0.35)
  Top 0.203: v16.76,14.85 16.76,15.39 v15.17,16.98 | U$3.35 30.31,20.57 v30.23,20.48 24.64,20.48 v24.38,20.23 | v32.26,22.8 v36.32,22.8 | v43.59,30.43 46.6,33.44 52.2,33.44 v52.83,34.07 | v17.53,23.63 15.42,23.63 12.05,20.26 v11.66,20.26
  Bottom 0.203: R2.5 17.24,14.37 v16.76,14.85 | v30.23,20.48 30.23,20.77 v32.26,22.8 | v36.32,22.8 37.37,23.84 37.46,23.84 43.59,29.97 v43.59,30.43 | v52.83,34.07 52.83,37.63 52.07,38.39 49.66,38.39 48.51,37.25 L_HEADERS.15 | v24.38,20.23 23.88,20.23 22.73,21.37 19.79,21.37 v17.53,23.63 | v11.66,20.26 14.93,16.98 v15.17,16.98
D+
  Top 0.203: X3.D+ 10.54,17.82 15.42,22.7 20.25,22.7 22.61,25.06 24.64,25.06 24.81,24.89 U$3.46
D-
  Top 0.203: X3.D- 9.89,17.63 15.28,23.03 20.11,23.03 22.52,25.44 24.89,25.44 25.31,24.77 U$3.45
FLASH_CS
  Top 0.203: R5.1 37.56,19.68 37.56,18.06 37.32,17.83 U3.1 36.03,17.15 35.53,16.64 U$3.24
FLASH_IO0
  Top 0.203: U$3.17 35.79,13.14 36.13,12.81 43.43,12.81 U3.5
FLASH_IO1  (via drill 0.35)
  Top 0.203: U$3.18 32.51,13.64 32.91,13.64 33.24,13.98 36.06,13.98 36.14,14.06 | 36.14,14.06 36.16,14.08 | v38.99,15.79 38.9,15.87 U3.2 | 36.14,14.06 41.86,14.06 v42.29,13.63
  Bottom 0.203: v38.99,15.79 39.84,15.79 41.55,14.28 41.63,14.21 41.71,14.21 v42.29,13.63
FLASH_IO2
  Top 0.203: U$3.19 32.9,14.14 33.07,14.31 35.92,14.31 36.22,14.6 U3.3
FLASH_IO3
  Top 0.203: U$3.20 32.79,14.64 32.8,14.64 35.78,14.64 36,14.85 36,15 36.13,15.13 36.18,15.13 36.2,15.15 42.93,15.15 43.65,15.87 U3.7
FLASH_SCK  (via drill 0.35)
  Top 0.203: U$3.23 35.66,16.14 35.94,16.42 40.13,16.42 v40.26,16.29 | v42.29,14.54 43.89,14.54 U3.6
  Bottom 0.203: v40.26,16.29 41.76,14.54 v42.29,14.54
GND  (via drill 0.25, 0.35)  (5 unrouted)
  Top 0.254: C5.2 23.11,9.44 v23.24,9.44
  Bottom 0.61: C2.1 3.65,19.3 v1.91,17.56
  pour Bottom: -2.16,39.66 -2.16,-0.98 57.28,-0.98 57.28,39.66
  pour Top: -3.94,40.68 58.8,40.68 58.8,-2.5 -3.94,-2.5
MISO  (via drill 0.35)
  Top 0.203: U$3.31 32.42,20.14 33.29,21.01 v34.34,21.01
  Bottom 0.203: v34.34,21.01 34.34,25.36 35.94,26.96 35.94,28.83 ICSP.1
MOSI  (via drill 0.35)
  Top 0.203: v33.53,19.35 33.32,19.14 U$3.29
  Bottom 0.203: ICSP.4 34.67,27.09 33.73,26.15 33.73,20.76 34.01,20.48 34.01,19.83 v33.53,19.35
N$1
  Top 0.406: X3.VBUS 9.24,13.28 8.95,13.57 5.53,13.57 5.46,13.5 4.7,13.5 4.06,12.86 F2.1
N$3  (via drill 0.25)
  Top 0.406: F2.2 TR1.1
  other vias: 4.06,10.13
N$4  (via drill 0.25)
  Top 0.254: v5.97,14.26 7.24,14.26 IC3.4 8.16,14.42 v8.51,14.77
  Bottom 0.254: TR1.3 2.92,10.06 2.92,13.25 3.94,14.26 v5.97,14.26 | R1.2 R1.3 10.14,14.66 10.03,14.77 v8.51,14.77
N$5  (via drill 0.25)
  Bottom 0.254: R2.1 20.65,8.35 ON.C
  other vias: 20.83,8.35
N$6  (1 unrouted)
N$7  (via drill 0.25)  (1 unrouted)
  Bottom 0.254: R2.2 18.94,8.69 v19.29,8.34
N$8  (via drill 0.25)  (1 unrouted)
  Bottom 0.254: R2.3 18.14,8.69 v17.79,8.34
N$9  (via drill 0.25)
  Bottom 0.254: R2.4 16.43,8.35 L.A
  other vias: 16.26,8.35
N$10  (via drill 0.25)
  Top 0.254: X3.ID 11.19,13.33 R1.1 | R11.1 5.25,17.15 IC3.1 IC3.2
  Bottom 0.254: R11.1 6.94,18.07 11.56,18.07 12.83,16.8 12.83,14.52 12.29,13.98 R1.1
  other vias: 6.01,17.15 11.84,13.98
N$11
  Top 0.152: C5.1 23.78,10.38 X4.P$1
  Top 0.203: U$3.1 23.81,11.05 X4.P$1
N$12
  Top 0.203: U$3.2 24.31,11.8 24.6,11.5 25.17,11.5 25.34,11.34 25.53,11.34 25.91,10.96 C1.1 25.91,10.07 25.4,9.56 24.64,9.56 24.13,9.05 X4.P$2
N$13
  Top 0.203: U$3.55 19.71,17.64 L1.P$2
N$14
  Top 0.203: U$3.53 20.01,18.64 19.69,18.96 L1.P$1 | L1.P$1 19.66,19.9 C9.1 17.32,20.1 C8.2 | L1.P$1 19.62,19.99 C4.1
N$15  (via drill 0.35)
  Top 0.813: D1.C R7.2
  Bottom 0.203: T2.2 12.48,26.96 13.47,26.96 13.51,26.92 R7.2
  other vias: 15.15,26.92
NEOPIX  (via drill 0.35)
  Top 0.203: LED1.1 29.48,9.69 v30.23,9.69 | v18.77,12.84 20.99,15.06 v20.99,15.12 | U$3.49 22.2,20.64 v22.1,20.74
  Bottom 0.203: v30.23,9.69 29.59,9.69 28.18,8.29 24.51,8.29 24.15,8.64 24.15,9.92 22.61,11.47 20.53,11.47 19.16,12.84 v18.77,12.84 | v22.1,20.74 22.1,20.43 22.42,20.1 22.42,16.55 v20.99,15.12
PWR_SWITCH  (via drill 0.25)
  Top 0.254: 13.59,27.98 13.3,27.98 13.04,28.23 v12.57,28.23 | 13.59,27.98 | 13.59,27.98 15.11,27.98 15.25,28.12 SW1.B 16.35,28.98 JP1.1 16.85,28.49 R7.1
  Bottom 0.254: T2.3 12.19,28.61 v12.57,28.23
PWRIN  (via drill 0.35)
  Bottom 0.813: L_HEADERS.1 43.73,1.65 42.29,3.09 42.29,8.93 38.71,12.51 31.24,12.51 24.47,12.51 24.44,12.48 20.96,12.48 14.61,18.83 14.61,24.93 13.21,26.33 11.53,26.33 10.93,26.92 D1.A
  other vias: 9.83,26.92
RXLED  (via drill 0.35)
  Top 0.152: U$3.9 27.81,13.25 26.92,14.13 v24.89,14.13 | v22.23,15.15 21.81,14.73 21.54,14.73 19.49,12.69 v19.49,11.65
  Bottom 0.152: R2.7 18.94,11.1 v19.49,11.65 | v24.89,14.13 22.99,14.13 v22.23,15.15
SCK  (via drill 0.35)
  Top 0.203: v33.4,20.23 32.81,19.64 U$3.30
  Bottom 0.203: ICSP.3 33.4,28.83 v33.4,20.23
SCL  (via drill 0.35)
  Top 0.203: U$3.64 21.59,13.14 v21.21,13.27 | v40.91,11.6 44.46,11.6 47.21,14.35 L_HEADERS.6
  Bottom 0.203: v21.21,13.27 21.61,13.12 24.18,13.12 24.2,13.14 39.36,13.14 v40.91,11.6
SDA  (via drill 0.35)
  Top 0.203: U$3.63 22.03,13.64 v21.78,14.15 | v41.55,11 44.49,11 45.3,11.81 L_HEADERS.5
  Bottom 0.203: v41.55,11 41.51,11.03 41.51,11.86 39.89,13.47 22.2,13.47 v21.78,14.15
SWCLK  (via drill 0.35)  (1 unrouted)
  Top 0.203: v30.91,19.92 30.52,19.92 30.48,19.88 29.98,19.88 29.93,19.92 24.94,19.92 24.64,19.62 24.16,19.62 24,19.47 24,16.93 23.72,16.64 U$3.57 | v32.51,21.5 33.97,21.5 34.09,21.62 34.68,21.62 35.05,21.25 37.97,21.25 38.35,20.87 R4.1
  Bottom 0.203: v30.91,19.92 32.49,21.5 v32.51,21.5
SWDIO  (via drill 0.35)
  Top 0.203: U$3.58 23.68,16.14 24.33,16.79 24.33,18.83 24.97,19.47 30.51,19.47 30.66,19.32 30.84,19.32 v31.12,19.04 | v53.09,15.79 53.09,18.03 52.91,18.2 52.91,25.01 v53.47,25.56 | v45.98,26.96 45.63,27.3 X2.2
  Bottom 0.203: v31.12,19.04 33.47,16.69 35.57,16.69 35.85,16.96 44.67,16.96 46.1,15.53 52.58,15.53 52.83,15.79 v53.09,15.79 | v53.47,25.56 53.21,25.82 47.12,25.82 v45.98,26.96
SWO  (via drill 0.35)
  Top 0.203: U$3.59 23.65,15.64 24.15,16.15 v24.53,16.15 v24.54,16.14 | v31.12,28.74 35.18,28.74 35.94,29.5 35.94,31.03 36.22,31.31 v39.8,31.31 | v43.31,34.33 44.07,33.57 v44.07,33.18 | v44.96,24.76 X2.6
  Bottom 0.203: v24.54,16.14 24.54,19.53 24.99,19.98 24.99,22.87 25.02,23.66 25.02,24.93 29.21,28.74 v31.12,28.74 | v39.8,31.31 40.8,31.31 43.31,33.82 v43.31,34.33 | v44.07,33.18 44.07,31.37 44.53,30.91 44.53,25.2 v44.96,24.76
TXLED  (via drill 0.35)
  Top 0.203: U$3.51 22.03,19.64 v21.82,19.85 | v19.94,15.02 18.16,13.25 v18.16,11.59
  Bottom 0.203: v19.94,15.02 20.44,15.52 20.53,15.52 21.82,16.81 v21.82,19.85 | v18.16,11.59 18.16,10.68 R2.6
USB_HOSTEN  (via drill 0.35)
  Top 0.254: v7.71,17.17 8.15,16.73 8.26,16.73 8.61,16.39 8.61,15.9 8.1,15.4 v5.72,15.4 | v3.24,16.23 2.1,16.23 v0.76,17.56 | v5.21,20.61 6.22,20.61 8,18.83 10.03,18.83 v10.13,18.73 | v29.72,10.58 29.36,10.94 29.36,11.09 28.98,11.47 28.58,11.47 28.31,11.73 U$3.10
  Bottom 0.254: R11.2 v7.71,17.17 | v5.72,15.4 4.06,15.4 v3.24,16.23 | v0.76,17.56 3.81,20.61 v5.21,20.61 | v10.13,18.73 11.53,18.73 13.21,17.06 13.21,16.42 13.84,15.79 16.72,15.79 20.68,11.82 22.88,11.82 24.51,10.2 24.51,8.79 24.66,8.64 27.67,8.64 27.7,8.67 28.07,8.67 29.72,10.32 v29.72,10.58
USHIELD  (2 unrouted)
  Top 0.406: X3.SPRT@1 6.94,12.28 X3.SPRT@3 7.04,9.68 X3.BASE@1 X3.BASE@2
  Top 0.813: FB2.2 15.71,13.33 14.96,12.58 X3.SPRT@2
VIN  (via drill 0.35)
  Top 0.203: v9.15,17.44 8.76,17.82 2.79,17.82 0.42,20.19 0.42,22.68 v3.94,26.2
  Top 0.813: C12.1 8.47,30.99 7.73,30.25 PC1.+ 7.73,27.46 6.48,26.2 v3.94,26.2
  Bottom 0.203: R1.6 10.46,15.16 10.46,14.99 10.68,14.77 12.18,14.77 12.47,15.06 12.47,16.27 11.3,17.44 v9.15,17.44
  Bottom 0.813: U1.3 2.31,26.2 v3.94,26.2 6.22,26.2 8.26,28.23 T2.1

### Text on the board
tPlace: D13 | D12 | 3V3 | D11 | AREF | D10 | A0 | D9 | A1 | D8 | A2 | D7 | A3 | D6 | A4 | D5 | A5 | D4 | SCL | D3 | SDA | D2 | 5V | GND | RST | RST | GND | D1 | PWRIN | D0
tOrigins: 5V | RST | SCK | MISO | G | 5V | MOSI | C:/Users/Shawn-Laptop/Creative Cloud Files/IronSAMD51 Art.bmp | C:/Users/Shawn-Laptop/Creative Cloud Files/IronSAMD51 Art.bmp